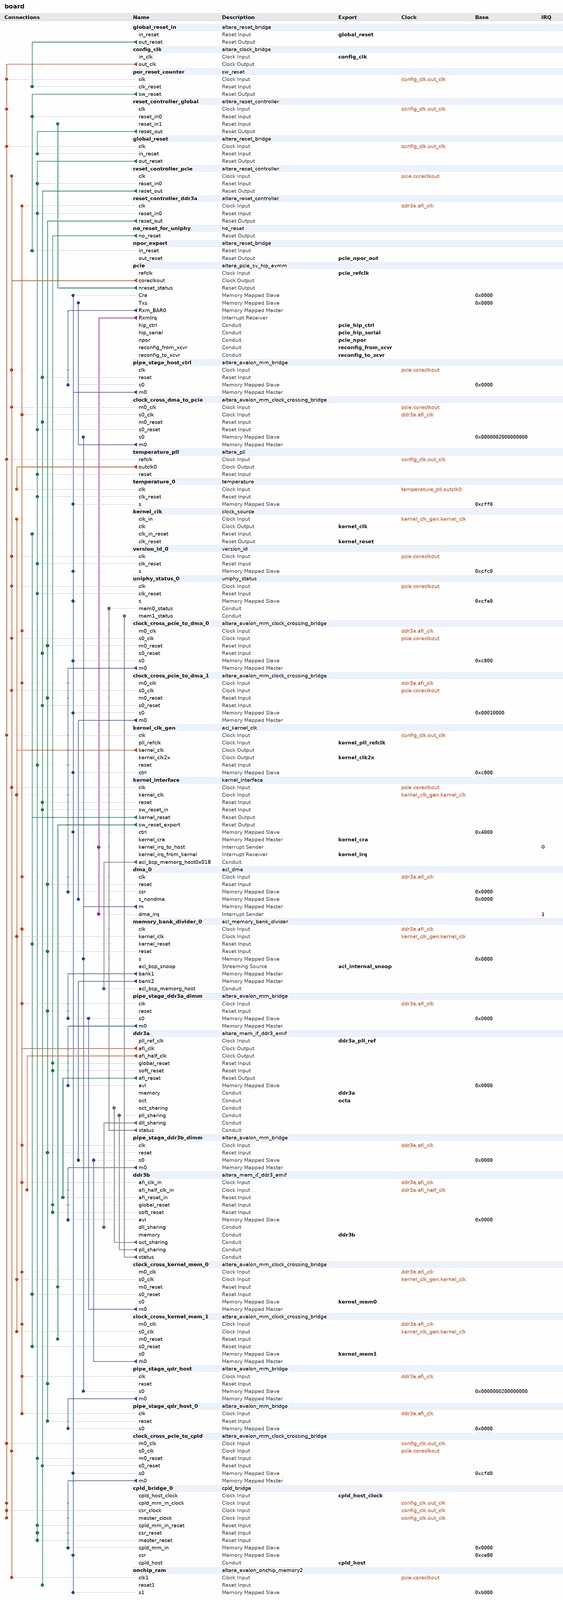
[diagram p0: system contents, whole]
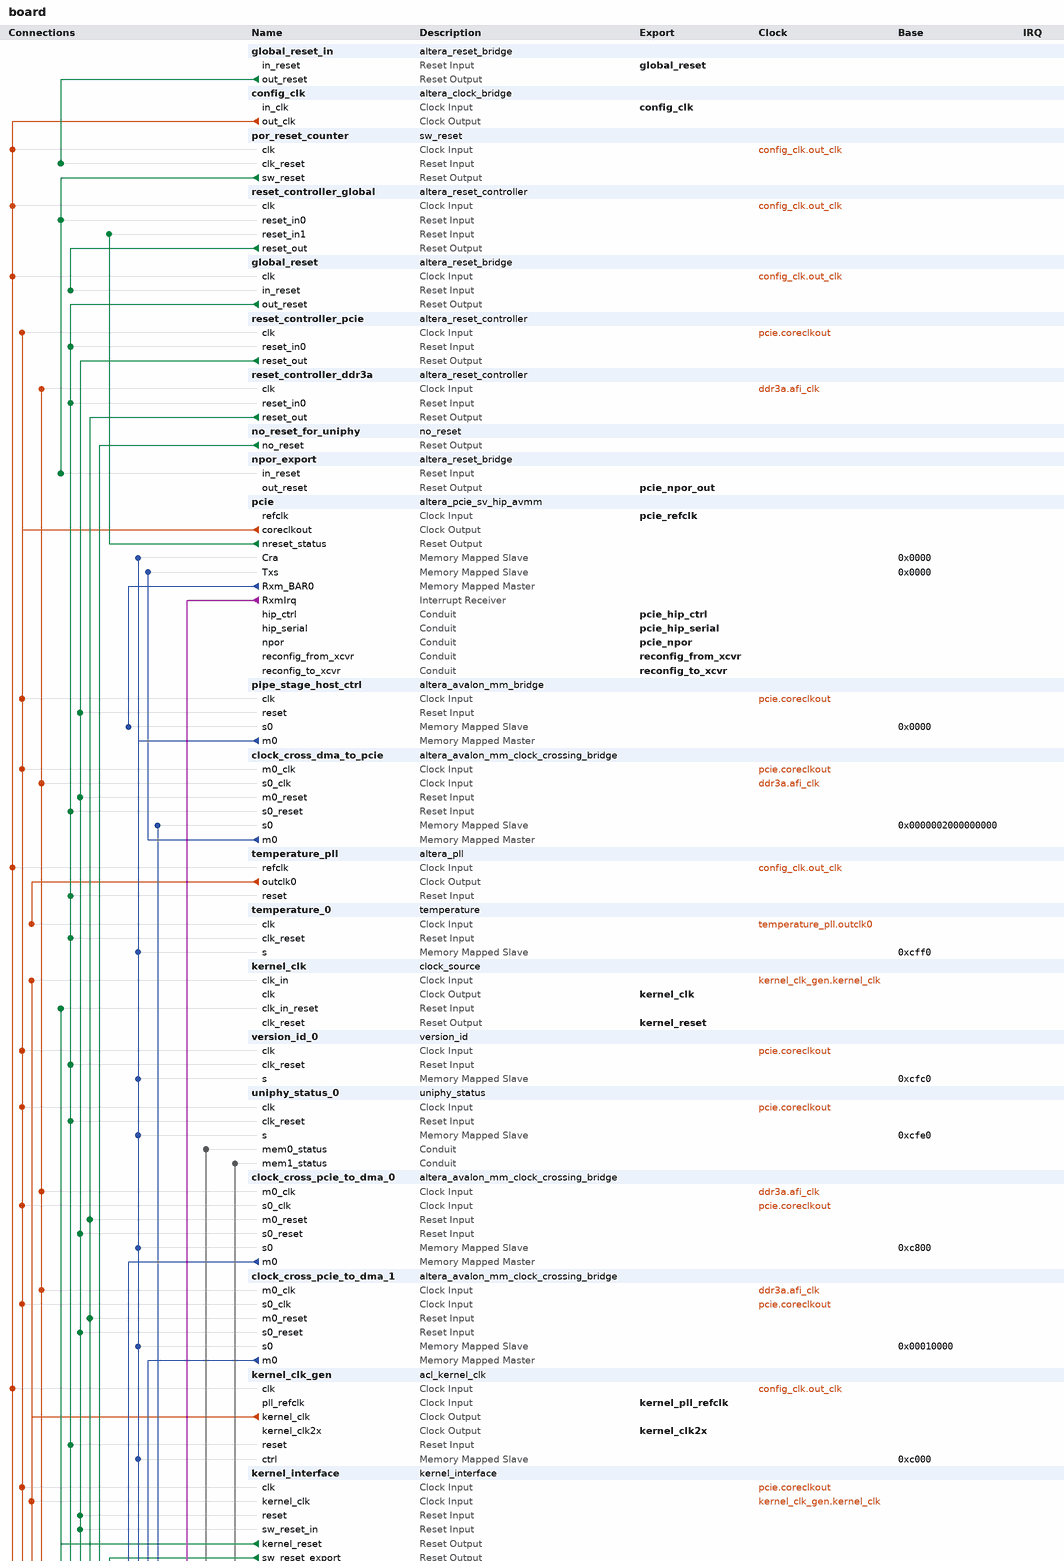
[diagram p1: system contents, upper part]
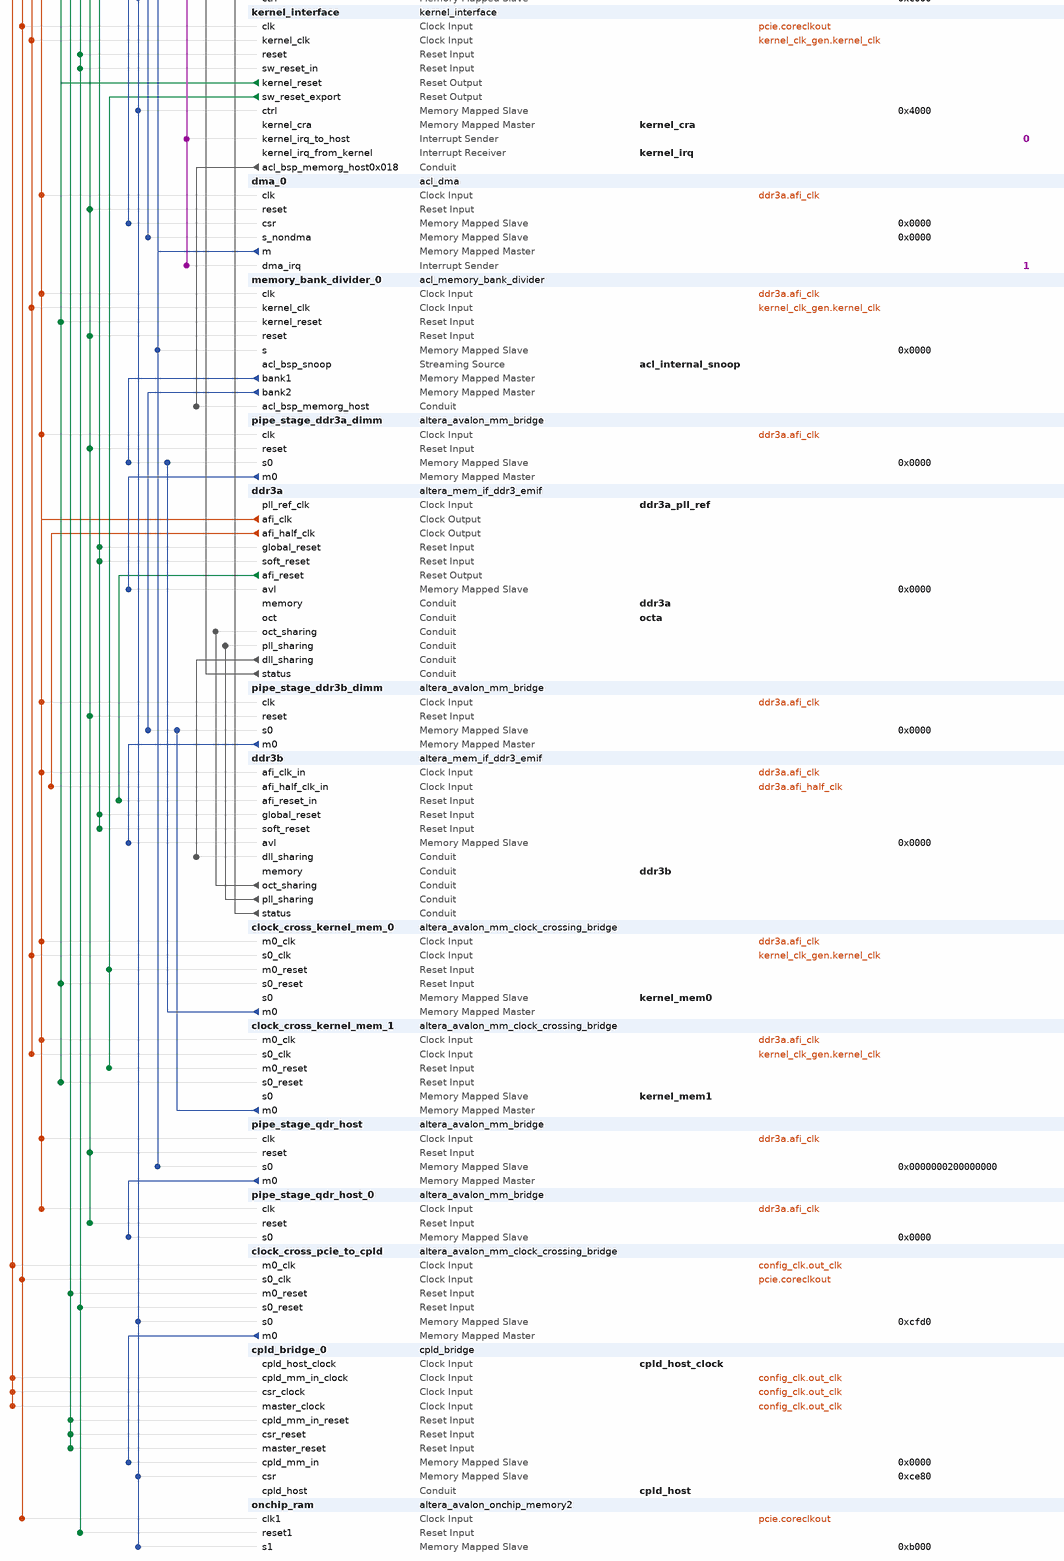
[diagram p2: system contents, lower part]
# Platform Designer (Qsys) system board, Stratix V Unknown
# Parameters at their usual value, and those the tool derives, are not listed.
package require -exact qsys 14.0
create_system board
set_project_property DEVICE_FAMILY {Stratix V}
set_project_property DEVICE Unknown

add_instance global_reset_in altera_reset_bridge 14.0
set_instance_parameter_value global_reset_in ACTIVE_LOW_RESET 1
set_instance_parameter_value global_reset_in SYNCHRONOUS_EDGES none

add_instance config_clk altera_clock_bridge 14.0
set_instance_parameter_value config_clk DERIVED_CLOCK_RATE 0
set_instance_parameter_value config_clk EXPLICIT_CLOCK_RATE 0

add_instance por_reset_counter sw_reset 10.0
set_instance_parameter_value por_reset_counter WIDTH 8
set_instance_parameter_value por_reset_counter LOG2_RESET_CYCLES 10

add_instance reset_controller_global altera_reset_controller 14.0
set_instance_parameter_value reset_controller_global NUM_RESET_INPUTS 2
set_instance_parameter_value reset_controller_global SYNC_DEPTH 2

add_instance global_reset altera_reset_bridge 14.0
set_instance_parameter_value global_reset ACTIVE_LOW_RESET 1
set_instance_parameter_value global_reset SYNCHRONOUS_EDGES deassert

add_instance reset_controller_pcie altera_reset_controller 14.0
set_instance_parameter_value reset_controller_pcie NUM_RESET_INPUTS 1
set_instance_parameter_value reset_controller_pcie SYNC_DEPTH 2

add_instance reset_controller_ddr3a altera_reset_controller 14.0
set_instance_parameter_value reset_controller_ddr3a NUM_RESET_INPUTS 1
set_instance_parameter_value reset_controller_ddr3a SYNC_DEPTH 2

add_instance no_reset_for_uniphy no_reset 10.0

add_instance npor_export altera_reset_bridge 14.0
set_instance_parameter_value npor_export ACTIVE_LOW_RESET 1
set_instance_parameter_value npor_export SYNCHRONOUS_EDGES none

add_instance pcie altera_pcie_sv_hip_avmm 14.0
set_instance_parameter_value pcie pcie_qsys 1
set_instance_parameter_value pcie lane_mask_hwtcl x8
set_instance_parameter_value pcie gen123_lane_rate_mode_hwtcl {Gen2 (5.0 Gbps)}
set_instance_parameter_value pcie port_type_hwtcl {Native endpoint}
set_instance_parameter_value pcie rxbuffer_rxreq_hwtcl Low
set_instance_parameter_value pcie pll_refclk_freq_hwtcl {100 MHz}
set_instance_parameter_value pcie set_pld_clk_x1_625MHz_hwtcl 0
set_instance_parameter_value pcie in_cvp_mode_hwtcl 1
set_instance_parameter_value pcie enable_tl_only_sim_hwtcl 0
set_instance_parameter_value pcie use_atx_pll_hwtcl 0
set_instance_parameter_value pcie hip_tag_checking_hwtcl 1
set_instance_parameter_value pcie enable_power_on_rst_pulse_hwtcl 0
set_instance_parameter_value pcie enable_pcisigtest_hwtcl 0
set_instance_parameter_value pcie SLAVE_ADDRESS_MAP_0 18
set_instance_parameter_value pcie SLAVE_ADDRESS_MAP_1 0
set_instance_parameter_value pcie SLAVE_ADDRESS_MAP_2 0
set_instance_parameter_value pcie SLAVE_ADDRESS_MAP_3 0
set_instance_parameter_value pcie SLAVE_ADDRESS_MAP_4 0
set_instance_parameter_value pcie SLAVE_ADDRESS_MAP_5 0
set_instance_parameter_value pcie NUM_PREFETCH_MASTERS 1
set_instance_parameter_value pcie bar0_type_hwtcl 1
set_instance_parameter_value pcie bar1_type_hwtcl 0
set_instance_parameter_value pcie bar2_type_hwtcl 0
set_instance_parameter_value pcie bar3_type_hwtcl 0
set_instance_parameter_value pcie bar4_type_hwtcl 0
set_instance_parameter_value pcie bar5_type_hwtcl 0
set_instance_parameter_value pcie CB_P2A_AVALON_ADDR_B0 0x00000000
set_instance_parameter_value pcie CB_P2A_AVALON_ADDR_B1 0x00000000
set_instance_parameter_value pcie CB_P2A_AVALON_ADDR_B2 0x00000000
set_instance_parameter_value pcie CB_P2A_AVALON_ADDR_B3 0x00000000
set_instance_parameter_value pcie CB_P2A_AVALON_ADDR_B4 0x00000000
set_instance_parameter_value pcie CB_P2A_AVALON_ADDR_B5 0x00000000
set_instance_parameter_value pcie fixed_address_mode 0
set_instance_parameter_value pcie CB_P2A_FIXED_AVALON_ADDR_B0 0
set_instance_parameter_value pcie CB_P2A_FIXED_AVALON_ADDR_B1 0
set_instance_parameter_value pcie CB_P2A_FIXED_AVALON_ADDR_B2 0
set_instance_parameter_value pcie CB_P2A_FIXED_AVALON_ADDR_B3 0
set_instance_parameter_value pcie CB_P2A_FIXED_AVALON_ADDR_B4 0
set_instance_parameter_value pcie CB_P2A_FIXED_AVALON_ADDR_B5 0
set_instance_parameter_value pcie vendor_id_hwtcl 4466
set_instance_parameter_value pcie device_id_hwtcl 55296
set_instance_parameter_value pcie revision_id_hwtcl 1
set_instance_parameter_value pcie class_code_hwtcl 16711680
set_instance_parameter_value pcie subsystem_vendor_id_hwtcl 4466
set_instance_parameter_value pcie subsystem_device_id_hwtcl 5
set_instance_parameter_value pcie max_payload_size_hwtcl 256
set_instance_parameter_value pcie extend_tag_field_hwtcl 32
set_instance_parameter_value pcie completion_timeout_hwtcl ABCD
set_instance_parameter_value pcie enable_completion_timeout_disable_hwtcl 1
set_instance_parameter_value pcie use_aer_hwtcl 0
set_instance_parameter_value pcie ecrc_check_capable_hwtcl 0
set_instance_parameter_value pcie ecrc_gen_capable_hwtcl 0
set_instance_parameter_value pcie use_crc_forwarding_hwtcl 0
set_instance_parameter_value pcie port_link_number_hwtcl 1
set_instance_parameter_value pcie dll_active_report_support_hwtcl 0
set_instance_parameter_value pcie surprise_down_error_support_hwtcl 0
set_instance_parameter_value pcie slotclkcfg_hwtcl 1
set_instance_parameter_value pcie msi_multi_message_capable_hwtcl 4
set_instance_parameter_value pcie msi_64bit_addressing_capable_hwtcl true
set_instance_parameter_value pcie msi_masking_capable_hwtcl false
set_instance_parameter_value pcie msi_support_hwtcl true
set_instance_parameter_value pcie enable_function_msix_support_hwtcl 0
set_instance_parameter_value pcie msix_table_size_hwtcl 0
set_instance_parameter_value pcie msix_table_offset_hwtcl 0
set_instance_parameter_value pcie msix_table_bir_hwtcl 0
set_instance_parameter_value pcie msix_pba_offset_hwtcl 0
set_instance_parameter_value pcie msix_pba_bir_hwtcl 0
set_instance_parameter_value pcie enable_slot_register_hwtcl 0
set_instance_parameter_value pcie slot_power_scale_hwtcl 0
set_instance_parameter_value pcie slot_power_limit_hwtcl 0
set_instance_parameter_value pcie slot_number_hwtcl 0
set_instance_parameter_value pcie endpoint_l0_latency_hwtcl 0
set_instance_parameter_value pcie endpoint_l1_latency_hwtcl 0
set_instance_parameter_value pcie CG_COMMON_CLOCK_MODE 1
set_instance_parameter_value pcie avmm_width_hwtcl 128
set_instance_parameter_value pcie AVALON_ADDR_WIDTH 32
set_instance_parameter_value pcie CB_PCIE_MODE 0
set_instance_parameter_value pcie CB_PCIE_RX_LITE 0
set_instance_parameter_value pcie AST_LITE 0
set_instance_parameter_value pcie CG_RXM_IRQ_NUM 16
set_instance_parameter_value pcie bypass_tl false
set_instance_parameter_value pcie CG_IMPL_CRA_AV_SLAVE_PORT 1
set_instance_parameter_value pcie CG_ENABLE_ADVANCED_INTERRUPT 0
set_instance_parameter_value pcie CG_ENABLE_A2P_INTERRUPT 0
set_instance_parameter_value pcie CG_ENABLE_HIP_STATUS 0
set_instance_parameter_value pcie CG_ENABLE_HIP_STATUS_EXTENSION 0
set_instance_parameter_value pcie TX_S_ADDR_WIDTH 32
set_instance_parameter_value pcie CB_A2P_ADDR_MAP_IS_FIXED 0
set_instance_parameter_value pcie CB_A2P_ADDR_MAP_NUM_ENTRIES 256
set_instance_parameter_value pcie CB_A2P_ADDR_MAP_PASS_THRU_BITS 12
set_instance_parameter_value pcie BYPASSS_A2P_TRANSLATION 0
set_instance_parameter_value pcie CB_RP_S_ADDR_WIDTH 32
set_instance_parameter_value pcie CB_A2P_ADDR_MAP_FIXED_TABLE_0_HIGH 0
set_instance_parameter_value pcie CB_A2P_ADDR_MAP_FIXED_TABLE_0_LOW 0
set_instance_parameter_value pcie CB_A2P_ADDR_MAP_FIXED_TABLE_1_HIGH 0
set_instance_parameter_value pcie CB_A2P_ADDR_MAP_FIXED_TABLE_1_LOW 0
set_instance_parameter_value pcie CB_A2P_ADDR_MAP_FIXED_TABLE_2_HIGH 0
set_instance_parameter_value pcie CB_A2P_ADDR_MAP_FIXED_TABLE_2_LOW 0
set_instance_parameter_value pcie CB_A2P_ADDR_MAP_FIXED_TABLE_3_HIGH 0
set_instance_parameter_value pcie CB_A2P_ADDR_MAP_FIXED_TABLE_3_LOW 0
set_instance_parameter_value pcie CB_A2P_ADDR_MAP_FIXED_TABLE_4_HIGH 0
set_instance_parameter_value pcie CB_A2P_ADDR_MAP_FIXED_TABLE_4_LOW 0
set_instance_parameter_value pcie CB_A2P_ADDR_MAP_FIXED_TABLE_5_HIGH 0
set_instance_parameter_value pcie CB_A2P_ADDR_MAP_FIXED_TABLE_5_LOW 0
set_instance_parameter_value pcie CB_A2P_ADDR_MAP_FIXED_TABLE_6_HIGH 0
set_instance_parameter_value pcie CB_A2P_ADDR_MAP_FIXED_TABLE_6_LOW 0
set_instance_parameter_value pcie CB_A2P_ADDR_MAP_FIXED_TABLE_7_HIGH 0
set_instance_parameter_value pcie CB_A2P_ADDR_MAP_FIXED_TABLE_7_LOW 0
set_instance_parameter_value pcie CB_A2P_ADDR_MAP_FIXED_TABLE_8_HIGH 0
set_instance_parameter_value pcie CB_A2P_ADDR_MAP_FIXED_TABLE_8_LOW 0
set_instance_parameter_value pcie CB_A2P_ADDR_MAP_FIXED_TABLE_9_HIGH 0
set_instance_parameter_value pcie CB_A2P_ADDR_MAP_FIXED_TABLE_9_LOW 0
set_instance_parameter_value pcie CB_A2P_ADDR_MAP_FIXED_TABLE_10_HIGH 0
set_instance_parameter_value pcie CB_A2P_ADDR_MAP_FIXED_TABLE_10_LOW 0
set_instance_parameter_value pcie CB_A2P_ADDR_MAP_FIXED_TABLE_11_HIGH 0
set_instance_parameter_value pcie CB_A2P_ADDR_MAP_FIXED_TABLE_11_LOW 0
set_instance_parameter_value pcie CB_A2P_ADDR_MAP_FIXED_TABLE_12_HIGH 0
set_instance_parameter_value pcie CB_A2P_ADDR_MAP_FIXED_TABLE_12_LOW 0
set_instance_parameter_value pcie CB_A2P_ADDR_MAP_FIXED_TABLE_13_HIGH 0
set_instance_parameter_value pcie CB_A2P_ADDR_MAP_FIXED_TABLE_13_LOW 0
set_instance_parameter_value pcie CB_A2P_ADDR_MAP_FIXED_TABLE_14_HIGH 0
set_instance_parameter_value pcie CB_A2P_ADDR_MAP_FIXED_TABLE_14_LOW 0
set_instance_parameter_value pcie CB_A2P_ADDR_MAP_FIXED_TABLE_15_HIGH 0
set_instance_parameter_value pcie CB_A2P_ADDR_MAP_FIXED_TABLE_15_LOW 0
set_instance_parameter_value pcie AddressPage "0\\,1\\,2\\,3\\,4\\,5\\,6\\,7\\,8\\,9\\,10\\,11\\,12\\,13\\,14\\,15"
set_instance_parameter_value pcie PCIeAddress63_32 "0x00000000\\,0x00000000\\,0x00000000\\,0x00000000\\,0x00000000\\,0x00000000\\,0x00000000\\,0x00000000\\,0x00000000\\,0x00000000\\,0x00000000\\,0x00000000\\,0x00000000\\,0x00000000\\,0x00000000\\,0x00000000"
set_instance_parameter_value pcie PCIeAddress31_0 "0x00000000\\,0x00000000\\,0x00000000\\,0x00000000\\,0x00000000\\,0x00000000\\,0x00000000\\,0x00000000\\,0x00000000\\,0x00000000\\,0x00000000\\,0x00000000\\,0x00000000\\,0x00000000\\,0x00000000\\,0x00000000"
set_instance_parameter_value pcie RXM_DATA_WIDTH 64
set_instance_parameter_value pcie RXM_BEN_WIDTH 8
set_instance_parameter_value pcie use_rx_st_be_hwtcl 0
set_instance_parameter_value pcie use_ast_parity 0
set_instance_parameter_value pcie hip_reconfig_hwtcl 0
set_instance_parameter_value pcie vsec_id_hwtcl 40960
set_instance_parameter_value pcie vsec_rev_hwtcl 0
set_instance_parameter_value pcie expansion_base_address_register_hwtcl 0
set_instance_parameter_value pcie io_window_addr_width_hwtcl 0
set_instance_parameter_value pcie prefetchable_mem_window_addr_width_hwtcl 0
set_instance_parameter_value pcie advanced_default_parameter_override 0
set_instance_parameter_value pcie override_tbpartner_driver_setting_hwtcl 0
set_instance_parameter_value pcie override_rxbuffer_cred_preset 0
set_instance_parameter_value pcie gen3_rxfreqlock_counter_hwtcl 0
set_instance_parameter_value pcie force_hrc 1
set_instance_parameter_value pcie force_src 0
set_instance_parameter_value pcie serial_sim_hwtcl 0
set_instance_parameter_value pcie advanced_default_hwtcl_bypass_cdc false
set_instance_parameter_value pcie advanced_default_hwtcl_enable_rx_buffer_checking false
set_instance_parameter_value pcie advanced_default_hwtcl_disable_link_x2_support false
set_instance_parameter_value pcie advanced_default_hwtcl_wrong_device_id disable
set_instance_parameter_value pcie advanced_default_hwtcl_data_pack_rx disable
set_instance_parameter_value pcie advanced_default_hwtcl_ltssm_1ms_timeout disable
set_instance_parameter_value pcie advanced_default_hwtcl_ltssm_freqlocked_check disable
set_instance_parameter_value pcie advanced_default_hwtcl_deskew_comma com_deskw
set_instance_parameter_value pcie advanced_default_hwtcl_device_number 0
set_instance_parameter_value pcie advanced_default_hwtcl_pipex1_debug_sel disable
set_instance_parameter_value pcie advanced_default_hwtcl_pclk_out_sel pclk
set_instance_parameter_value pcie advanced_default_hwtcl_no_soft_reset false
set_instance_parameter_value pcie advanced_default_hwtcl_maximum_current 0
set_instance_parameter_value pcie advanced_default_hwtcl_d1_support false
set_instance_parameter_value pcie advanced_default_hwtcl_d2_support false
set_instance_parameter_value pcie advanced_default_hwtcl_d0_pme false
set_instance_parameter_value pcie advanced_default_hwtcl_d1_pme false
set_instance_parameter_value pcie advanced_default_hwtcl_d2_pme false
set_instance_parameter_value pcie advanced_default_hwtcl_d3_hot_pme false
set_instance_parameter_value pcie advanced_default_hwtcl_d3_cold_pme false
set_instance_parameter_value pcie advanced_default_hwtcl_low_priority_vc single_vc
set_instance_parameter_value pcie advanced_default_hwtcl_disable_snoop_packet false
set_instance_parameter_value pcie advanced_default_hwtcl_enable_l1_aspm false
set_instance_parameter_value pcie advanced_default_hwtcl_set_l0s 0
set_instance_parameter_value pcie advanced_default_hwtcl_l1_exit_latency_sameclock 0
set_instance_parameter_value pcie advanced_default_hwtcl_l1_exit_latency_diffclock 0
set_instance_parameter_value pcie advanced_default_hwtcl_hot_plug_support 0
set_instance_parameter_value pcie advanced_default_hwtcl_extended_tag_reset false
set_instance_parameter_value pcie advanced_default_hwtcl_no_command_completed true
set_instance_parameter_value pcie advanced_default_hwtcl_interrupt_pin inta
set_instance_parameter_value pcie advanced_default_hwtcl_bridge_port_vga_enable false
set_instance_parameter_value pcie advanced_default_hwtcl_bridge_port_ssid_support false
set_instance_parameter_value pcie advanced_default_hwtcl_ssvid 0
set_instance_parameter_value pcie advanced_default_hwtcl_ssid 0
set_instance_parameter_value pcie advanced_default_hwtcl_eie_before_nfts_count 4
set_instance_parameter_value pcie advanced_default_hwtcl_gen2_diffclock_nfts_count 255
set_instance_parameter_value pcie advanced_default_hwtcl_gen2_sameclock_nfts_count 255
set_instance_parameter_value pcie advanced_default_hwtcl_l0_exit_latency_sameclock 6
set_instance_parameter_value pcie advanced_default_hwtcl_l0_exit_latency_diffclock 6
set_instance_parameter_value pcie advanced_default_hwtcl_atomic_op_routing false
set_instance_parameter_value pcie advanced_default_hwtcl_atomic_op_completer_32bit false
set_instance_parameter_value pcie advanced_default_hwtcl_atomic_op_completer_64bit false
set_instance_parameter_value pcie advanced_default_hwtcl_cas_completer_128bit false
set_instance_parameter_value pcie advanced_default_hwtcl_ltr_mechanism false
set_instance_parameter_value pcie advanced_default_hwtcl_tph_completer false
set_instance_parameter_value pcie advanced_default_hwtcl_extended_format_field false
set_instance_parameter_value pcie advanced_default_hwtcl_atomic_malformed true
set_instance_parameter_value pcie advanced_default_hwtcl_flr_capability false
set_instance_parameter_value pcie advanced_default_hwtcl_enable_adapter_half_rate_mode false
set_instance_parameter_value pcie advanced_default_hwtcl_vc0_clk_enable true
set_instance_parameter_value pcie advanced_default_hwtcl_register_pipe_signals false
set_instance_parameter_value pcie advanced_default_hwtcl_skp_os_gen3_count 0
set_instance_parameter_value pcie advanced_default_hwtcl_tx_cdc_almost_empty 5
set_instance_parameter_value pcie advanced_default_hwtcl_rx_l0s_count_idl 0
set_instance_parameter_value pcie advanced_default_hwtcl_cdc_dummy_insert_limit 11
set_instance_parameter_value pcie advanced_default_hwtcl_ei_delay_powerdown_count 10
set_instance_parameter_value pcie advanced_default_hwtcl_skp_os_schedule_count 0
set_instance_parameter_value pcie advanced_default_hwtcl_fc_init_timer 1024
set_instance_parameter_value pcie advanced_default_hwtcl_l01_entry_latency 31
set_instance_parameter_value pcie advanced_default_hwtcl_flow_control_update_count 30
set_instance_parameter_value pcie advanced_default_hwtcl_flow_control_timeout_count 200
set_instance_parameter_value pcie advanced_default_hwtcl_retry_buffer_last_active_address 2047
set_instance_parameter_value pcie advanced_default_hwtcl_reserved_debug 0
set_instance_parameter_value pcie hwtcl_override_g2_txvod 1
set_instance_parameter_value pcie rpre_emph_a_val_hwtcl 9
set_instance_parameter_value pcie rpre_emph_b_val_hwtcl 0
set_instance_parameter_value pcie rpre_emph_c_val_hwtcl 16
set_instance_parameter_value pcie rpre_emph_d_val_hwtcl 13
set_instance_parameter_value pcie rpre_emph_e_val_hwtcl 5
set_instance_parameter_value pcie rvod_sel_a_val_hwtcl 42
set_instance_parameter_value pcie rvod_sel_b_val_hwtcl 38
set_instance_parameter_value pcie rvod_sel_c_val_hwtcl 38
set_instance_parameter_value pcie rvod_sel_d_val_hwtcl 43
set_instance_parameter_value pcie rvod_sel_e_val_hwtcl 15

add_instance pipe_stage_host_ctrl altera_avalon_mm_bridge 14.0
set_instance_parameter_value pipe_stage_host_ctrl DATA_WIDTH 32
set_instance_parameter_value pipe_stage_host_ctrl ADDRESS_WIDTH 18
set_instance_parameter_value pipe_stage_host_ctrl USE_AUTO_ADDRESS_WIDTH 0
set_instance_parameter_value pipe_stage_host_ctrl ADDRESS_UNITS SYMBOLS
set_instance_parameter_value pipe_stage_host_ctrl MAX_PENDING_RESPONSES 1

add_instance clock_cross_dma_to_pcie altera_avalon_mm_clock_crossing_bridge 14.0
set_instance_parameter_value clock_cross_dma_to_pcie DATA_WIDTH 512
set_instance_parameter_value clock_cross_dma_to_pcie ADDRESS_WIDTH 20
set_instance_parameter_value clock_cross_dma_to_pcie USE_AUTO_ADDRESS_WIDTH 0
set_instance_parameter_value clock_cross_dma_to_pcie MAX_BURST_SIZE 16
set_instance_parameter_value clock_cross_dma_to_pcie COMMAND_FIFO_DEPTH 16
set_instance_parameter_value clock_cross_dma_to_pcie RESPONSE_FIFO_DEPTH 64
set_instance_parameter_value clock_cross_dma_to_pcie MASTER_SYNC_DEPTH 3
set_instance_parameter_value clock_cross_dma_to_pcie SLAVE_SYNC_DEPTH 3

add_instance temperature_pll altera_pll 14.0
set_instance_parameter_value temperature_pll gui_device_speed_grade 2
set_instance_parameter_value temperature_pll gui_pll_mode {Integer-N PLL}
set_instance_parameter_value temperature_pll gui_reference_clock_frequency 100.0
set_instance_parameter_value temperature_pll gui_operation_mode direct
set_instance_parameter_value temperature_pll gui_use_locked true
set_instance_parameter_value temperature_pll gui_number_of_clocks 1
set_instance_parameter_value temperature_pll gui_output_clock_frequency0 80.0

add_instance temperature_0 temperature 10.0

add_instance kernel_clk clock_source 14.0
set_instance_parameter_value kernel_clk clockFrequency 50000000
set_instance_parameter_value kernel_clk clockFrequencyKnown false
set_instance_parameter_value kernel_clk resetSynchronousEdges DEASSERT

add_instance version_id_0 version_id 10.0
set_instance_parameter_value version_id_0 WIDTH 32
set_instance_parameter_value version_id_0 VERSION_ID -1597521439

add_instance uniphy_status_0 uniphy_status 10.0
set_instance_parameter_value uniphy_status_0 WIDTH 32
set_instance_parameter_value uniphy_status_0 NUM_UNIPHYS 2

add_instance clock_cross_pcie_to_dma_0 altera_avalon_mm_clock_crossing_bridge 14.0
set_instance_parameter_value clock_cross_pcie_to_dma_0 DATA_WIDTH 32
set_instance_parameter_value clock_cross_pcie_to_dma_0 ADDRESS_WIDTH 10
set_instance_parameter_value clock_cross_pcie_to_dma_0 USE_AUTO_ADDRESS_WIDTH 0
set_instance_parameter_value clock_cross_pcie_to_dma_0 MAX_BURST_SIZE 1
set_instance_parameter_value clock_cross_pcie_to_dma_0 COMMAND_FIFO_DEPTH 4
set_instance_parameter_value clock_cross_pcie_to_dma_0 RESPONSE_FIFO_DEPTH 4
set_instance_parameter_value clock_cross_pcie_to_dma_0 MASTER_SYNC_DEPTH 3
set_instance_parameter_value clock_cross_pcie_to_dma_0 SLAVE_SYNC_DEPTH 3

add_instance clock_cross_pcie_to_dma_1 altera_avalon_mm_clock_crossing_bridge 14.0
set_instance_parameter_value clock_cross_pcie_to_dma_1 DATA_WIDTH 32
set_instance_parameter_value clock_cross_pcie_to_dma_1 ADDRESS_WIDTH 16
set_instance_parameter_value clock_cross_pcie_to_dma_1 USE_AUTO_ADDRESS_WIDTH 0
set_instance_parameter_value clock_cross_pcie_to_dma_1 MAX_BURST_SIZE 1
set_instance_parameter_value clock_cross_pcie_to_dma_1 COMMAND_FIFO_DEPTH 4
set_instance_parameter_value clock_cross_pcie_to_dma_1 RESPONSE_FIFO_DEPTH 4
set_instance_parameter_value clock_cross_pcie_to_dma_1 MASTER_SYNC_DEPTH 3
set_instance_parameter_value clock_cross_pcie_to_dma_1 SLAVE_SYNC_DEPTH 3

add_instance kernel_clk_gen acl_kernel_clk 1.0
set_instance_parameter_value kernel_clk_gen REF_CLK_RATE 100
set_instance_parameter_value kernel_clk_gen KERNEL_TARGET_CLOCK_RATE 380

add_instance kernel_interface kernel_interface 1.0
set_instance_parameter_value kernel_interface NUM_GLOBAL_MEMS 1

add_instance dma_0 acl_dma 1.0
set_instance_parameter_value dma_0 BYTE_ADDR_WIDTH 38
set_instance_parameter_value dma_0 DATA_WIDTH 512
set_instance_parameter_value dma_0 BURST_SIZE 16

add_instance memory_bank_divider_0 acl_memory_bank_divider 1.0
set_instance_parameter_value memory_bank_divider_0 NUM_BANKS 2
set_instance_parameter_value memory_bank_divider_0 SEPARATE_RW_PORTS false
set_instance_parameter_value memory_bank_divider_0 PIPELINE_OUTPUTS false
set_instance_parameter_value memory_bank_divider_0 DATA_WIDTH 512
set_instance_parameter_value memory_bank_divider_0 ADDRESS_WIDTH 33
set_instance_parameter_value memory_bank_divider_0 BURST_SIZE 16
set_instance_parameter_value memory_bank_divider_0 MAX_PENDING_READS 64

add_instance pipe_stage_ddr3a_dimm altera_avalon_mm_bridge 14.0
set_instance_parameter_value pipe_stage_ddr3a_dimm DATA_WIDTH 512
set_instance_parameter_value pipe_stage_ddr3a_dimm ADDRESS_WIDTH 32
set_instance_parameter_value pipe_stage_ddr3a_dimm USE_AUTO_ADDRESS_WIDTH 0
set_instance_parameter_value pipe_stage_ddr3a_dimm ADDRESS_UNITS SYMBOLS
set_instance_parameter_value pipe_stage_ddr3a_dimm MAX_BURST_SIZE 16
set_instance_parameter_value pipe_stage_ddr3a_dimm MAX_PENDING_RESPONSES 32

add_instance ddr3a altera_mem_if_ddr3_emif 14.0
set_instance_parameter_value ddr3a MEM_VENDOR Micron
set_instance_parameter_value ddr3a MEM_FORMAT DISCRETE
set_instance_parameter_value ddr3a MEM_CLK_FREQ_MAX 800.0
set_instance_parameter_value ddr3a MEM_ROW_ADDR_WIDTH 16
set_instance_parameter_value ddr3a MEM_COL_ADDR_WIDTH 10
set_instance_parameter_value ddr3a MEM_DQ_WIDTH 64
set_instance_parameter_value ddr3a MEM_BANKADDR_WIDTH 3
set_instance_parameter_value ddr3a MEM_VERBOSE false
set_instance_parameter_value ddr3a MEM_ASR Automatic
set_instance_parameter_value ddr3a MEM_DRV_STR RZQ/6
set_instance_parameter_value ddr3a MEM_RTT_NOM RZQ/4
set_instance_parameter_value ddr3a MEM_WTCL 8
set_instance_parameter_value ddr3a MEM_TCL 11
set_instance_parameter_value ddr3a TIMING_TIS 170
set_instance_parameter_value ddr3a TIMING_TIH 120
set_instance_parameter_value ddr3a TIMING_TDS 10
set_instance_parameter_value ddr3a TIMING_TDH 45
set_instance_parameter_value ddr3a TIMING_TDQSQ 100
set_instance_parameter_value ddr3a TIMING_TDQSCK 225
set_instance_parameter_value ddr3a TIMING_TDQSS 0.27
set_instance_parameter_value ddr3a TIMING_TQSH 0.4
set_instance_parameter_value ddr3a TIMING_TDSH 0.18
set_instance_parameter_value ddr3a TIMING_TDSS 0.18
set_instance_parameter_value ddr3a MEM_TRAS_NS 35.0
set_instance_parameter_value ddr3a MEM_TRCD_NS 13.75
set_instance_parameter_value ddr3a MEM_TRP_NS 13.75
set_instance_parameter_value ddr3a MEM_TRFC_NS 260.0
set_instance_parameter_value ddr3a MEM_TWTR 6
set_instance_parameter_value ddr3a MEM_TFAW_NS 30.0
set_instance_parameter_value ddr3a MEM_TRRD_NS 7.5
set_instance_parameter_value ddr3a MEM_TRTP_NS 7.5
set_instance_parameter_value ddr3a RATE Quarter
set_instance_parameter_value ddr3a MEM_CLK_FREQ 800.0
set_instance_parameter_value ddr3a SPEED_GRADE 2
set_instance_parameter_value ddr3a HARD_EMIF false
set_instance_parameter_value ddr3a POWER_OF_TWO_BUS true
set_instance_parameter_value ddr3a AVL_MAX_SIZE 16
set_instance_parameter_value ddr3a CTL_LOOK_AHEAD_DEPTH 8
set_instance_parameter_value ddr3a PRIORITY_PORT 1,1,1,1,1,1
set_instance_parameter_value ddr3a CPORT_TYPE_PORT Bidirectional,Bidirectional,Bidirectional,Bidirectional,Bidirectional,Bidirectional
set_instance_parameter_value ddr3a REF_CLK_FREQ 100.0
set_instance_parameter_value ddr3a PLL_SHARING_MODE Master
set_instance_parameter_value ddr3a EXPORT_AFI_HALF_CLK false
set_instance_parameter_value ddr3a PLL_LOCATION Top_Bottom
set_instance_parameter_value ddr3a CALIBRATION_MODE Skip
set_instance_parameter_value ddr3a USER_DEBUG_LEVEL 0
set_instance_parameter_value ddr3a TIMING_BOARD_MAX_CK_DELAY 0.499
set_instance_parameter_value ddr3a TIMING_BOARD_MAX_DQS_DELAY 0.4071
set_instance_parameter_value ddr3a TIMING_BOARD_SKEW_CKDQS_DIMM_MIN -0.01
set_instance_parameter_value ddr3a TIMING_BOARD_SKEW_CKDQS_DIMM_MAX 0.01
set_instance_parameter_value ddr3a TIMING_BOARD_SKEW_WITHIN_DQS 0.01
set_instance_parameter_value ddr3a TIMING_BOARD_SKEW_BETWEEN_DQS 0.236
set_instance_parameter_value ddr3a TIMING_BOARD_DQ_TO_DQS_SKEW 0.0
set_instance_parameter_value ddr3a TIMING_BOARD_AC_SKEW 0.016
set_instance_parameter_value ddr3a TIMING_BOARD_AC_TO_CK_SKEW 0.0
set_instance_parameter_value ddr3a DLL_SHARING_MODE Master
set_instance_parameter_value ddr3a OCT_SHARING_MODE Master

add_instance pipe_stage_ddr3b_dimm altera_avalon_mm_bridge 14.0
set_instance_parameter_value pipe_stage_ddr3b_dimm DATA_WIDTH 512
set_instance_parameter_value pipe_stage_ddr3b_dimm ADDRESS_WIDTH 32
set_instance_parameter_value pipe_stage_ddr3b_dimm USE_AUTO_ADDRESS_WIDTH 0
set_instance_parameter_value pipe_stage_ddr3b_dimm ADDRESS_UNITS SYMBOLS
set_instance_parameter_value pipe_stage_ddr3b_dimm MAX_BURST_SIZE 16
set_instance_parameter_value pipe_stage_ddr3b_dimm MAX_PENDING_RESPONSES 32

add_instance ddr3b altera_mem_if_ddr3_emif 14.0
set_instance_parameter_value ddr3b MEM_VENDOR Micron
set_instance_parameter_value ddr3b MEM_FORMAT DISCRETE
set_instance_parameter_value ddr3b MEM_CLK_FREQ_MAX 800.0
set_instance_parameter_value ddr3b MEM_ROW_ADDR_WIDTH 16
set_instance_parameter_value ddr3b MEM_COL_ADDR_WIDTH 10
set_instance_parameter_value ddr3b MEM_DQ_WIDTH 64
set_instance_parameter_value ddr3b MEM_BANKADDR_WIDTH 3
set_instance_parameter_value ddr3b MEM_VERBOSE false
set_instance_parameter_value ddr3b MEM_ASR Automatic
set_instance_parameter_value ddr3b MEM_DRV_STR RZQ/6
set_instance_parameter_value ddr3b MEM_RTT_NOM RZQ/4
set_instance_parameter_value ddr3b MEM_WTCL 8
set_instance_parameter_value ddr3b MEM_TCL 11
set_instance_parameter_value ddr3b TIMING_TIS 170
set_instance_parameter_value ddr3b TIMING_TIH 120
set_instance_parameter_value ddr3b TIMING_TDS 10
set_instance_parameter_value ddr3b TIMING_TDH 45
set_instance_parameter_value ddr3b TIMING_TDQSQ 100
set_instance_parameter_value ddr3b TIMING_TDQSCK 225
set_instance_parameter_value ddr3b TIMING_TDQSS 0.27
set_instance_parameter_value ddr3b TIMING_TQSH 0.4
set_instance_parameter_value ddr3b TIMING_TDSH 0.18
set_instance_parameter_value ddr3b TIMING_TDSS 0.18
set_instance_parameter_value ddr3b MEM_TRAS_NS 35.0
set_instance_parameter_value ddr3b MEM_TRCD_NS 13.75
set_instance_parameter_value ddr3b MEM_TRP_NS 13.75
set_instance_parameter_value ddr3b MEM_TRFC_NS 260.0
set_instance_parameter_value ddr3b MEM_TWTR 6
set_instance_parameter_value ddr3b MEM_TFAW_NS 30.0
set_instance_parameter_value ddr3b MEM_TRRD_NS 7.5
set_instance_parameter_value ddr3b MEM_TRTP_NS 7.5
set_instance_parameter_value ddr3b RATE Quarter
set_instance_parameter_value ddr3b MEM_CLK_FREQ 800.0
set_instance_parameter_value ddr3b SPEED_GRADE 2
set_instance_parameter_value ddr3b HARD_EMIF false
set_instance_parameter_value ddr3b POWER_OF_TWO_BUS true
set_instance_parameter_value ddr3b AVL_MAX_SIZE 16
set_instance_parameter_value ddr3b CTL_LOOK_AHEAD_DEPTH 8
set_instance_parameter_value ddr3b PRIORITY_PORT 1,1,1,1,1,1
set_instance_parameter_value ddr3b CPORT_TYPE_PORT Bidirectional,Bidirectional,Bidirectional,Bidirectional,Bidirectional,Bidirectional
set_instance_parameter_value ddr3b REF_CLK_FREQ 100.0
set_instance_parameter_value ddr3b PLL_SHARING_MODE Slave
set_instance_parameter_value ddr3b EXPORT_AFI_HALF_CLK false
set_instance_parameter_value ddr3b PLL_LOCATION Top_Bottom
set_instance_parameter_value ddr3b CALIBRATION_MODE Skip
set_instance_parameter_value ddr3b USER_DEBUG_LEVEL 0
set_instance_parameter_value ddr3b TIMING_BOARD_MAX_CK_DELAY 0.499
set_instance_parameter_value ddr3b TIMING_BOARD_MAX_DQS_DELAY 0.4071
set_instance_parameter_value ddr3b TIMING_BOARD_SKEW_CKDQS_DIMM_MIN -0.01
set_instance_parameter_value ddr3b TIMING_BOARD_SKEW_CKDQS_DIMM_MAX 0.01
set_instance_parameter_value ddr3b TIMING_BOARD_SKEW_WITHIN_DQS 0.01
set_instance_parameter_value ddr3b TIMING_BOARD_SKEW_BETWEEN_DQS 0.236
set_instance_parameter_value ddr3b TIMING_BOARD_DQ_TO_DQS_SKEW 0.0
set_instance_parameter_value ddr3b TIMING_BOARD_AC_SKEW 0.016
set_instance_parameter_value ddr3b TIMING_BOARD_AC_TO_CK_SKEW 0.0
set_instance_parameter_value ddr3b DLL_SHARING_MODE Slave
set_instance_parameter_value ddr3b OCT_SHARING_MODE Slave

add_instance clock_cross_kernel_mem_0 altera_avalon_mm_clock_crossing_bridge 14.0
set_instance_parameter_value clock_cross_kernel_mem_0 DATA_WIDTH 512
set_instance_parameter_value clock_cross_kernel_mem_0 ADDRESS_WIDTH 32
set_instance_parameter_value clock_cross_kernel_mem_0 USE_AUTO_ADDRESS_WIDTH 0
set_instance_parameter_value clock_cross_kernel_mem_0 MAX_BURST_SIZE 16
set_instance_parameter_value clock_cross_kernel_mem_0 COMMAND_FIFO_DEPTH 16
set_instance_parameter_value clock_cross_kernel_mem_0 RESPONSE_FIFO_DEPTH 512
set_instance_parameter_value clock_cross_kernel_mem_0 MASTER_SYNC_DEPTH 3
set_instance_parameter_value clock_cross_kernel_mem_0 SLAVE_SYNC_DEPTH 3

add_instance clock_cross_kernel_mem_1 altera_avalon_mm_clock_crossing_bridge 14.0
set_instance_parameter_value clock_cross_kernel_mem_1 DATA_WIDTH 512
set_instance_parameter_value clock_cross_kernel_mem_1 ADDRESS_WIDTH 32
set_instance_parameter_value clock_cross_kernel_mem_1 USE_AUTO_ADDRESS_WIDTH 0
set_instance_parameter_value clock_cross_kernel_mem_1 MAX_BURST_SIZE 16
set_instance_parameter_value clock_cross_kernel_mem_1 COMMAND_FIFO_DEPTH 16
set_instance_parameter_value clock_cross_kernel_mem_1 RESPONSE_FIFO_DEPTH 512
set_instance_parameter_value clock_cross_kernel_mem_1 MASTER_SYNC_DEPTH 3
set_instance_parameter_value clock_cross_kernel_mem_1 SLAVE_SYNC_DEPTH 3

add_instance pipe_stage_qdr_host altera_avalon_mm_bridge 14.0
set_instance_parameter_value pipe_stage_qdr_host DATA_WIDTH 512
set_instance_parameter_value pipe_stage_qdr_host ADDRESS_WIDTH 26
set_instance_parameter_value pipe_stage_qdr_host USE_AUTO_ADDRESS_WIDTH 0
set_instance_parameter_value pipe_stage_qdr_host ADDRESS_UNITS SYMBOLS
set_instance_parameter_value pipe_stage_qdr_host MAX_BURST_SIZE 16
set_instance_parameter_value pipe_stage_qdr_host MAX_PENDING_RESPONSES 16

add_instance pipe_stage_qdr_host_0 altera_avalon_mm_bridge 14.0
set_instance_parameter_value pipe_stage_qdr_host_0 DATA_WIDTH 128
set_instance_parameter_value pipe_stage_qdr_host_0 ADDRESS_WIDTH 26
set_instance_parameter_value pipe_stage_qdr_host_0 USE_AUTO_ADDRESS_WIDTH 0
set_instance_parameter_value pipe_stage_qdr_host_0 ADDRESS_UNITS SYMBOLS
set_instance_parameter_value pipe_stage_qdr_host_0 MAX_BURST_SIZE 16
set_instance_parameter_value pipe_stage_qdr_host_0 MAX_PENDING_RESPONSES 16

add_instance clock_cross_pcie_to_cpld altera_avalon_mm_clock_crossing_bridge 14.0
set_instance_parameter_value clock_cross_pcie_to_cpld DATA_WIDTH 32
set_instance_parameter_value clock_cross_pcie_to_cpld ADDRESS_WIDTH 3
set_instance_parameter_value clock_cross_pcie_to_cpld USE_AUTO_ADDRESS_WIDTH 0
set_instance_parameter_value clock_cross_pcie_to_cpld MAX_BURST_SIZE 1
set_instance_parameter_value clock_cross_pcie_to_cpld COMMAND_FIFO_DEPTH 16
set_instance_parameter_value clock_cross_pcie_to_cpld RESPONSE_FIFO_DEPTH 16
set_instance_parameter_value clock_cross_pcie_to_cpld MASTER_SYNC_DEPTH 3
set_instance_parameter_value clock_cross_pcie_to_cpld SLAVE_SYNC_DEPTH 3

add_instance cpld_bridge_0 cpld_bridge 1.0

add_instance onchip_ram altera_avalon_onchip_memory2 14.0
set_instance_parameter_value onchip_ram dataWidth 32
set_instance_parameter_value onchip_ram dualPort false
set_instance_parameter_value onchip_ram initMemContent true
set_instance_parameter_value onchip_ram initializationFileName onchip_ram.hex
set_instance_parameter_value onchip_ram memorySize 1024
set_instance_parameter_value onchip_ram useNonDefaultInitFile true

# connections
add_connection config_clk.out_clk clock_cross_pcie_to_cpld.m0_clk clock
add_connection config_clk.out_clk cpld_bridge_0.cpld_mm_in_clock clock
add_connection config_clk.out_clk cpld_bridge_0.csr_clock clock
add_connection config_clk.out_clk cpld_bridge_0.master_clock clock
add_connection config_clk.out_clk global_reset.clk clock
add_connection config_clk.out_clk kernel_clk_gen.clk clock
add_connection config_clk.out_clk por_reset_counter.clk clock
add_connection config_clk.out_clk reset_controller_global.clk clock
add_connection config_clk.out_clk temperature_pll.refclk clock
add_connection ddr3a.afi_clk clock_cross_dma_to_pcie.s0_clk clock
add_connection ddr3a.afi_clk clock_cross_kernel_mem_0.m0_clk clock
add_connection ddr3a.afi_clk clock_cross_kernel_mem_1.m0_clk clock
add_connection ddr3a.afi_clk clock_cross_pcie_to_dma_0.m0_clk clock
add_connection ddr3a.afi_clk clock_cross_pcie_to_dma_1.m0_clk clock
add_connection ddr3a.afi_clk ddr3b.afi_clk_in clock
add_connection ddr3a.afi_clk dma_0.clk clock
add_connection ddr3a.afi_clk memory_bank_divider_0.clk clock
add_connection ddr3a.afi_clk pipe_stage_ddr3a_dimm.clk clock
add_connection ddr3a.afi_clk pipe_stage_ddr3b_dimm.clk clock
add_connection ddr3a.afi_clk pipe_stage_qdr_host.clk clock
add_connection ddr3a.afi_clk pipe_stage_qdr_host_0.clk clock
add_connection ddr3a.afi_clk reset_controller_ddr3a.clk clock
add_connection ddr3a.afi_half_clk ddr3b.afi_half_clk_in clock
add_connection kernel_clk_gen.kernel_clk clock_cross_kernel_mem_0.s0_clk clock
add_connection kernel_clk_gen.kernel_clk clock_cross_kernel_mem_1.s0_clk clock
add_connection kernel_clk_gen.kernel_clk kernel_clk.clk_in clock
add_connection kernel_clk_gen.kernel_clk kernel_interface.kernel_clk clock
add_connection kernel_clk_gen.kernel_clk memory_bank_divider_0.kernel_clk clock
add_connection pcie.coreclkout clock_cross_dma_to_pcie.m0_clk clock
add_connection pcie.coreclkout clock_cross_pcie_to_cpld.s0_clk clock
add_connection pcie.coreclkout clock_cross_pcie_to_dma_0.s0_clk clock
add_connection pcie.coreclkout clock_cross_pcie_to_dma_1.s0_clk clock
add_connection pcie.coreclkout kernel_interface.clk clock
add_connection pcie.coreclkout onchip_ram.clk1 clock
add_connection pcie.coreclkout pipe_stage_host_ctrl.clk clock
add_connection pcie.coreclkout reset_controller_pcie.clk clock
add_connection pcie.coreclkout uniphy_status_0.clk clock
add_connection pcie.coreclkout version_id_0.clk clock
add_connection temperature_pll.outclk0 temperature_0.clk clock
add_connection ddr3a.afi_reset ddr3b.afi_reset_in reset
add_connection global_reset.out_reset clock_cross_dma_to_pcie.s0_reset reset
add_connection global_reset.out_reset clock_cross_pcie_to_cpld.m0_reset reset
add_connection global_reset.out_reset cpld_bridge_0.cpld_mm_in_reset reset
add_connection global_reset.out_reset cpld_bridge_0.csr_reset reset
add_connection global_reset.out_reset cpld_bridge_0.master_reset reset
add_connection global_reset.out_reset kernel_clk_gen.reset reset
add_connection global_reset.out_reset reset_controller_ddr3a.reset_in0 reset
add_connection global_reset.out_reset reset_controller_pcie.reset_in0 reset
add_connection global_reset.out_reset temperature_0.clk_reset reset
add_connection global_reset.out_reset temperature_pll.reset reset
add_connection global_reset.out_reset uniphy_status_0.clk_reset reset
add_connection global_reset.out_reset version_id_0.clk_reset reset
add_connection global_reset_in.out_reset por_reset_counter.clk_reset reset
add_connection kernel_interface.kernel_reset clock_cross_kernel_mem_0.s0_reset reset
add_connection kernel_interface.kernel_reset clock_cross_kernel_mem_1.s0_reset reset
add_connection kernel_interface.kernel_reset kernel_clk.clk_in_reset reset
add_connection kernel_interface.kernel_reset memory_bank_divider_0.kernel_reset reset
add_connection kernel_interface.sw_reset_export clock_cross_kernel_mem_0.m0_reset reset
add_connection kernel_interface.sw_reset_export clock_cross_kernel_mem_1.m0_reset reset
add_connection no_reset_for_uniphy.no_reset ddr3a.global_reset reset
add_connection no_reset_for_uniphy.no_reset ddr3a.soft_reset reset
add_connection no_reset_for_uniphy.no_reset ddr3b.global_reset reset
add_connection no_reset_for_uniphy.no_reset ddr3b.soft_reset reset
add_connection pcie.nreset_status reset_controller_global.reset_in1 reset
add_connection por_reset_counter.sw_reset npor_export.in_reset reset
add_connection por_reset_counter.sw_reset reset_controller_global.reset_in0 reset
add_connection reset_controller_ddr3a.reset_out clock_cross_pcie_to_dma_0.m0_reset reset
add_connection reset_controller_ddr3a.reset_out clock_cross_pcie_to_dma_1.m0_reset reset
add_connection reset_controller_ddr3a.reset_out dma_0.reset reset
add_connection reset_controller_ddr3a.reset_out memory_bank_divider_0.reset reset
add_connection reset_controller_ddr3a.reset_out pipe_stage_ddr3a_dimm.reset reset
add_connection reset_controller_ddr3a.reset_out pipe_stage_ddr3b_dimm.reset reset
add_connection reset_controller_ddr3a.reset_out pipe_stage_qdr_host.reset reset
add_connection reset_controller_ddr3a.reset_out pipe_stage_qdr_host_0.reset reset
add_connection reset_controller_global.reset_out global_reset.in_reset reset
add_connection reset_controller_pcie.reset_out clock_cross_dma_to_pcie.m0_reset reset
add_connection reset_controller_pcie.reset_out clock_cross_pcie_to_cpld.s0_reset reset
add_connection reset_controller_pcie.reset_out clock_cross_pcie_to_dma_0.s0_reset reset
add_connection reset_controller_pcie.reset_out clock_cross_pcie_to_dma_1.s0_reset reset
add_connection reset_controller_pcie.reset_out kernel_interface.reset reset
add_connection reset_controller_pcie.reset_out kernel_interface.sw_reset_in reset
add_connection reset_controller_pcie.reset_out onchip_ram.reset1 reset
add_connection reset_controller_pcie.reset_out pipe_stage_host_ctrl.reset reset
add_connection clock_cross_dma_to_pcie.m0 pcie.Txs avalon
set_connection_parameter_value clock_cross_dma_to_pcie.m0/pcie.Txs baseAddress 0x0000
add_connection clock_cross_kernel_mem_0.m0 pipe_stage_ddr3a_dimm.s0 avalon
set_connection_parameter_value clock_cross_kernel_mem_0.m0/pipe_stage_ddr3a_dimm.s0 baseAddress 0x0000
add_connection clock_cross_kernel_mem_1.m0 pipe_stage_ddr3b_dimm.s0 avalon
set_connection_parameter_value clock_cross_kernel_mem_1.m0/pipe_stage_ddr3b_dimm.s0 baseAddress 0x0000
add_connection clock_cross_pcie_to_cpld.m0 cpld_bridge_0.cpld_mm_in avalon
set_connection_parameter_value clock_cross_pcie_to_cpld.m0/cpld_bridge_0.cpld_mm_in baseAddress 0x0000
add_connection clock_cross_pcie_to_dma_0.m0 dma_0.csr avalon
set_connection_parameter_value clock_cross_pcie_to_dma_0.m0/dma_0.csr baseAddress 0x0000
add_connection clock_cross_pcie_to_dma_1.m0 dma_0.s_nondma avalon
set_connection_parameter_value clock_cross_pcie_to_dma_1.m0/dma_0.s_nondma baseAddress 0x0000
add_connection dma_0.m clock_cross_dma_to_pcie.s0 avalon
set_connection_parameter_value dma_0.m/clock_cross_dma_to_pcie.s0 baseAddress 0x0000002000000000
add_connection dma_0.m memory_bank_divider_0.s avalon
set_connection_parameter_value dma_0.m/memory_bank_divider_0.s baseAddress 0x0000
add_connection dma_0.m pipe_stage_qdr_host.s0 avalon
set_connection_parameter_value dma_0.m/pipe_stage_qdr_host.s0 baseAddress 0x0000000200000000
add_connection memory_bank_divider_0.bank1 pipe_stage_ddr3a_dimm.s0 avalon
set_connection_parameter_value memory_bank_divider_0.bank1/pipe_stage_ddr3a_dimm.s0 baseAddress 0x0000
add_connection memory_bank_divider_0.bank2 pipe_stage_ddr3b_dimm.s0 avalon
set_connection_parameter_value memory_bank_divider_0.bank2/pipe_stage_ddr3b_dimm.s0 baseAddress 0x0000
add_connection pcie.Rxm_BAR0 pipe_stage_host_ctrl.s0 avalon
set_connection_parameter_value pcie.Rxm_BAR0/pipe_stage_host_ctrl.s0 baseAddress 0x0000
add_connection pipe_stage_ddr3a_dimm.m0 ddr3a.avl avalon
set_connection_parameter_value pipe_stage_ddr3a_dimm.m0/ddr3a.avl baseAddress 0x0000
add_connection pipe_stage_ddr3b_dimm.m0 ddr3b.avl avalon
set_connection_parameter_value pipe_stage_ddr3b_dimm.m0/ddr3b.avl baseAddress 0x0000
add_connection pipe_stage_host_ctrl.m0 clock_cross_pcie_to_cpld.s0 avalon
set_connection_parameter_value pipe_stage_host_ctrl.m0/clock_cross_pcie_to_cpld.s0 baseAddress 0xcfd0
add_connection pipe_stage_host_ctrl.m0 clock_cross_pcie_to_dma_0.s0 avalon
set_connection_parameter_value pipe_stage_host_ctrl.m0/clock_cross_pcie_to_dma_0.s0 baseAddress 0xc800
add_connection pipe_stage_host_ctrl.m0 clock_cross_pcie_to_dma_1.s0 avalon
set_connection_parameter_value pipe_stage_host_ctrl.m0/clock_cross_pcie_to_dma_1.s0 baseAddress 0x00010000
add_connection pipe_stage_host_ctrl.m0 cpld_bridge_0.csr avalon
set_connection_parameter_value pipe_stage_host_ctrl.m0/cpld_bridge_0.csr baseAddress 0xce80
add_connection pipe_stage_host_ctrl.m0 kernel_clk_gen.ctrl avalon
set_connection_parameter_value pipe_stage_host_ctrl.m0/kernel_clk_gen.ctrl baseAddress 0xc000
add_connection pipe_stage_host_ctrl.m0 kernel_interface.ctrl avalon
set_connection_parameter_value pipe_stage_host_ctrl.m0/kernel_interface.ctrl baseAddress 0x4000
add_connection pipe_stage_host_ctrl.m0 onchip_ram.s1 avalon
set_connection_parameter_value pipe_stage_host_ctrl.m0/onchip_ram.s1 baseAddress 0xb000
add_connection pipe_stage_host_ctrl.m0 pcie.Cra avalon
set_connection_parameter_value pipe_stage_host_ctrl.m0/pcie.Cra baseAddress 0x0000
add_connection pipe_stage_host_ctrl.m0 temperature_0.s avalon
set_connection_parameter_value pipe_stage_host_ctrl.m0/temperature_0.s baseAddress 0xcff0
add_connection pipe_stage_host_ctrl.m0 uniphy_status_0.s avalon
set_connection_parameter_value pipe_stage_host_ctrl.m0/uniphy_status_0.s baseAddress 0xcfe0
add_connection pipe_stage_host_ctrl.m0 version_id_0.s avalon
set_connection_parameter_value pipe_stage_host_ctrl.m0/version_id_0.s baseAddress 0xcfc0
add_connection pipe_stage_qdr_host.m0 pipe_stage_qdr_host_0.s0 avalon
set_connection_parameter_value pipe_stage_qdr_host.m0/pipe_stage_qdr_host_0.s0 baseAddress 0x0000
add_connection ddr3a.dll_sharing ddr3b.dll_sharing conduit
add_connection ddr3a.status uniphy_status_0.mem0_status conduit
add_connection ddr3b.oct_sharing ddr3a.oct_sharing conduit
add_connection ddr3b.pll_sharing ddr3a.pll_sharing conduit
add_connection ddr3b.status uniphy_status_0.mem1_status conduit
add_connection kernel_interface.acl_bsp_memorg_host0x018 memory_bank_divider_0.acl_bsp_memorg_host conduit
add_connection pcie.RxmIrq dma_0.dma_irq interrupt
set_connection_parameter_value pcie.RxmIrq/dma_0.dma_irq irqNumber 1
add_connection pcie.RxmIrq kernel_interface.kernel_irq_to_host interrupt
set_connection_parameter_value pcie.RxmIrq/kernel_interface.kernel_irq_to_host irqNumber 0

# exported interfaces
add_interface global_reset reset sink
set_interface_property global_reset EXPORT_OF global_reset_in.in_reset
add_interface pcie_refclk clock sink
set_interface_property pcie_refclk EXPORT_OF pcie.refclk
add_interface pcie_hip_serial conduit end
set_interface_property pcie_hip_serial EXPORT_OF pcie.hip_serial
add_interface pcie_npor conduit end
set_interface_property pcie_npor EXPORT_OF pcie.npor
add_interface ddr3a conduit end
set_interface_property ddr3a EXPORT_OF ddr3a.memory
add_interface octa conduit end
set_interface_property octa EXPORT_OF ddr3a.oct
add_interface ddr3a_pll_ref clock sink
set_interface_property ddr3a_pll_ref EXPORT_OF ddr3a.pll_ref_clk
add_interface ddr3b conduit end
set_interface_property ddr3b EXPORT_OF ddr3b.memory
add_interface pcie_hip_ctrl conduit end
set_interface_property pcie_hip_ctrl EXPORT_OF pcie.hip_ctrl
add_interface config_clk clock sink
set_interface_property config_clk EXPORT_OF config_clk.in_clk
add_interface kernel_pll_refclk clock sink
set_interface_property kernel_pll_refclk EXPORT_OF kernel_clk_gen.pll_refclk
add_interface kernel_cra avalon master
set_interface_property kernel_cra EXPORT_OF kernel_interface.kernel_cra
add_interface kernel_irq interrupt receiver
set_interface_property kernel_irq EXPORT_OF kernel_interface.kernel_irq_from_kernel
add_interface kernel_mem0 avalon slave
set_interface_property kernel_mem0 EXPORT_OF clock_cross_kernel_mem_0.s0
add_interface kernel_mem1 avalon slave
set_interface_property kernel_mem1 EXPORT_OF clock_cross_kernel_mem_1.s0
add_interface acl_internal_snoop avalon_streaming source
set_interface_property acl_internal_snoop EXPORT_OF memory_bank_divider_0.acl_bsp_snoop
add_interface kernel_clk clock source
set_interface_property kernel_clk EXPORT_OF kernel_clk.clk
add_interface kernel_reset reset source
set_interface_property kernel_reset EXPORT_OF kernel_clk.clk_reset
add_interface pcie_npor_out reset source
set_interface_property pcie_npor_out EXPORT_OF npor_export.out_reset
add_interface reconfig_to_xcvr conduit end
set_interface_property reconfig_to_xcvr EXPORT_OF pcie.reconfig_to_xcvr
add_interface reconfig_from_xcvr conduit end
set_interface_property reconfig_from_xcvr EXPORT_OF pcie.reconfig_from_xcvr
add_interface kernel_clk2x clock source
set_interface_property kernel_clk2x EXPORT_OF kernel_clk_gen.kernel_clk2x
add_interface cpld_host conduit end
set_interface_property cpld_host EXPORT_OF cpld_bridge_0.cpld_host
add_interface cpld_host_clock clock sink
set_interface_property cpld_host_clock EXPORT_OF cpld_bridge_0.cpld_host_clock

set_interconnect_requirement {$system} qsys_mm.clockCrossingAdapter HANDSHAKE
set_interconnect_requirement {$system} qsys_mm.maxAdditionalLatency 2
set_interconnect_requirement new_target new_requirement_name new_requirement_value
set_interconnect_requirement new_target new_requirement_name_0 new_requirement_value

save_system board.qsys
